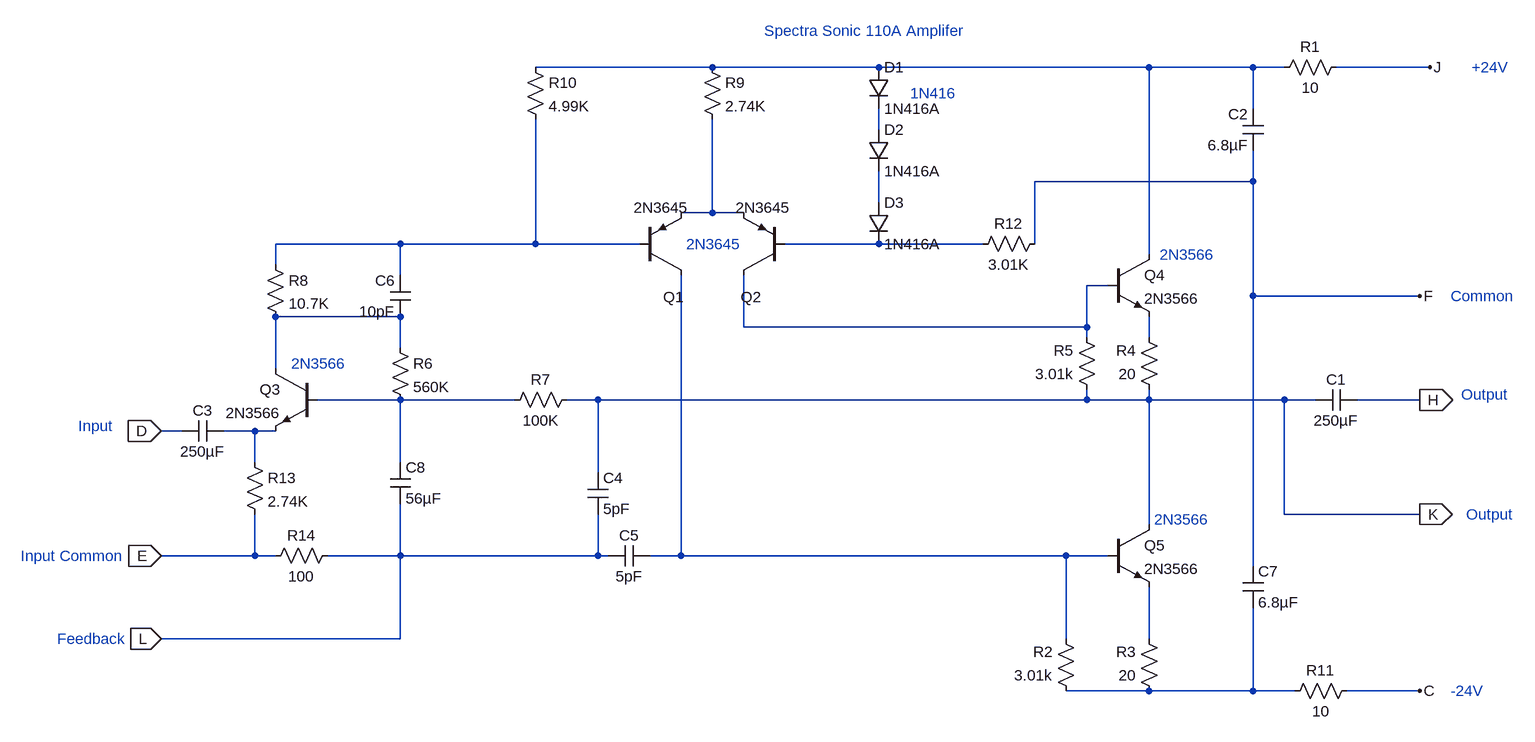
[diagram p0: schematic 110A.asc]
110A.asc, the LTspice schematic file:
Version 4.1
SHEET 1 964 4856
WIRE -1904 -1520 -2176 -1520
WIRE -1648 -1520 -1904 -1520
WIRE -1232 -1520 -1648 -1520
WIRE -1072 -1520 -1232 -1520
WIRE -1024 -1520 -1072 -1520
WIRE -800 -1520 -944 -1520
WIRE -1072 -1456 -1072 -1520
WIRE -1648 -1424 -1648 -1456
WIRE -1072 -1344 -1072 -1392
WIRE -1072 -1344 -1408 -1344
WIRE -1648 -1312 -1648 -1360
WIRE -1904 -1296 -1904 -1440
WIRE -1904 -1296 -1952 -1296
WIRE -1856 -1296 -1904 -1296
WIRE -2384 -1248 -2576 -1248
WIRE -2176 -1248 -2176 -1440
WIRE -2176 -1248 -2384 -1248
WIRE -2016 -1248 -2176 -1248
WIRE -1648 -1248 -1792 -1248
WIRE -1488 -1248 -1648 -1248
WIRE -1408 -1248 -1408 -1344
WIRE -1232 -1232 -1232 -1520
WIRE -2576 -1216 -2576 -1248
WIRE -2384 -1200 -2384 -1248
WIRE -1296 -1184 -1328 -1184
WIRE -1072 -1168 -1072 -1344
WIRE -816 -1168 -1072 -1168
WIRE -2384 -1136 -2576 -1136
WIRE -1856 -1120 -1856 -1200
WIRE -1328 -1120 -1328 -1184
WIRE -1328 -1120 -1856 -1120
WIRE -1328 -1104 -1328 -1120
WIRE -1232 -1104 -1232 -1136
WIRE -2384 -1088 -2384 -1136
WIRE -2576 -1056 -2576 -1136
WIRE -2384 -1008 -2512 -1008
WIRE -2208 -1008 -2384 -1008
WIRE -2080 -1008 -2128 -1008
WIRE -1328 -1008 -1328 -1024
WIRE -1328 -1008 -2080 -1008
WIRE -1232 -1008 -1232 -1024
WIRE -1232 -1008 -1328 -1008
WIRE -1024 -1008 -1232 -1008
WIRE -976 -1008 -1024 -1008
WIRE -816 -1008 -912 -1008
WIRE -2720 -960 -2752 -960
WIRE -2608 -960 -2656 -960
WIRE -2576 -960 -2608 -960
WIRE -2608 -912 -2608 -960
WIRE -2384 -912 -2384 -1008
WIRE -2080 -896 -2080 -1008
WIRE -1024 -832 -1024 -1008
WIRE -816 -832 -1024 -832
WIRE -1232 -816 -1232 -1008
WIRE -2608 -768 -2608 -832
WIRE -2608 -768 -2752 -768
WIRE -2576 -768 -2608 -768
WIRE -2384 -768 -2384 -848
WIRE -2384 -768 -2496 -768
WIRE -2080 -768 -2080 -832
WIRE -2080 -768 -2384 -768
WIRE -2064 -768 -2080 -768
WIRE -1952 -768 -1952 -1200
WIRE -1952 -768 -2000 -768
WIRE -1360 -768 -1952 -768
WIRE -1296 -768 -1360 -768
WIRE -1072 -752 -1072 -1168
WIRE -2384 -640 -2384 -768
WIRE -2384 -640 -2752 -640
WIRE -1360 -640 -1360 -768
WIRE -1232 -640 -1232 -720
WIRE -1232 -560 -1360 -560
WIRE -1072 -560 -1072 -688
WIRE -1072 -560 -1232 -560
WIRE -1008 -560 -1072 -560
WIRE -816 -560 -928 -560
FLAG -800 -1520 J
FLAG -2752 -960 D
IOPIN -2752 -960 In
FLAG -2752 -768 E
IOPIN -2752 -768 In
FLAG -816 -560 C
FLAG -816 -832 K
IOPIN -816 -832 Out
FLAG -816 -1168 F
FLAG -816 -1008 H
IOPIN -816 -1008 Out
FLAG -2752 -640 L
IOPIN -2752 -640 In
SYMBOL pnp -1792 -1200 R180
WINDOW 0 36 -34 Left 2
WINDOW 3 -9 104 Left 2
SYMATTR InstName Q2
SYMATTR Value 2N3645
SYMBOL pnp -2016 -1200 M180
WINDOW 0 36 -34 Left 2
WINDOW 3 -9 104 Left 2
SYMATTR InstName Q1
SYMATTR Value 2N3645
SYMBOL npn -2512 -1056 M0
SYMATTR InstName Q3
SYMATTR Value 2N3566
SYMBOL npn -1296 -1232 R0
SYMATTR InstName Q4
SYMATTR Value 2N3566
SYMBOL npn -1296 -816 R0
SYMATTR InstName Q5
SYMATTR Value 2N3566
SYMBOL diode -1664 -1520 R0
SYMATTR InstName D1
SYMATTR Value 1N416A
SYMBOL diode -1664 -1424 R0
SYMATTR InstName D2
SYMATTR Value 1N416A
SYMBOL diode -1664 -1312 R0
SYMATTR InstName D3
SYMATTR Value 1N416A
SYMBOL res -928 -1536 R90
WINDOW 0 0 56 VBottom 2
WINDOW 3 32 56 VTop 2
SYMATTR InstName R1
SYMATTR Value 10
SYMBOL res -1344 -544 R180
WINDOW 0 36 76 Left 2
WINDOW 3 36 40 Left 2
SYMATTR InstName R2
SYMATTR Value 3.01k
SYMBOL res -1216 -544 R180
WINDOW 0 36 76 Left 2
WINDOW 3 36 40 Left 2
SYMATTR InstName R3
SYMATTR Value 20
SYMBOL res -1216 -1008 R180
WINDOW 0 36 76 Left 2
WINDOW 3 36 40 Left 2
SYMATTR InstName R4
SYMATTR Value 20
SYMBOL res -1312 -1008 R180
WINDOW 0 36 76 Left 2
WINDOW 3 36 40 Left 2
SYMATTR InstName R5
SYMATTR Value 3.01k
SYMBOL cap -912 -1024 R90
WINDOW 0 0 32 VBottom 2
WINDOW 3 32 32 VTop 2
SYMATTR InstName C1
SYMATTR Value 250µF
SYMBOL cap -1056 -1392 R180
WINDOW 0 24 56 Left 2
WINDOW 3 24 8 Left 2
SYMATTR InstName C2
SYMATTR Value 6.8µF
SYMBOL cap -2656 -976 R90
WINDOW 0 0 32 VBottom 2
WINDOW 3 32 32 VTop 2
SYMATTR InstName C3
SYMATTR Value 250µF
SYMBOL res -2400 -1104 R0
SYMATTR InstName R6
SYMATTR Value 560K
SYMBOL res -2112 -1024 R90
WINDOW 0 0 56 VBottom 2
WINDOW 3 32 56 VTop 2
SYMATTR InstName R7
SYMATTR Value 100K
SYMBOL cap -2096 -896 R0
SYMATTR InstName C4
SYMATTR Value 5pF
SYMBOL cap -2000 -784 R90
WINDOW 0 0 32 VBottom 2
WINDOW 3 32 32 VTop 2
SYMATTR InstName C5
SYMATTR Value 5pF
SYMBOL cap -2368 -1136 R180
WINDOW 0 24 56 Left 2
WINDOW 3 24 8 Left 2
SYMATTR InstName C6
SYMATTR Value 10pF
SYMBOL res -2592 -1232 R0
SYMATTR InstName R8
SYMATTR Value 10.7K
SYMBOL res -1920 -1536 R0
SYMATTR InstName R9
SYMATTR Value 2.74K
SYMBOL res -2192 -1536 R0
SYMATTR InstName R10
SYMATTR Value 4.99K
SYMBOL res -912 -576 R90
WINDOW 0 0 56 VBottom 2
WINDOW 3 32 56 VTop 2
SYMATTR InstName R11
SYMATTR Value 10
SYMBOL cap -1088 -752 R0
SYMATTR InstName C7
SYMATTR Value 6.8µF
SYMBOL res -1392 -1264 R90
WINDOW 0 0 56 VBottom 2
WINDOW 3 32 56 VTop 2
SYMATTR InstName R12
SYMATTR Value 3.01K
SYMBOL res -2624 -928 R0
SYMATTR InstName R13
SYMATTR Value 2.74K
SYMBOL res -2480 -784 R90
WINDOW 0 0 56 VBottom 2
WINDOW 3 32 56 VTop 2
SYMATTR InstName R14
SYMATTR Value 100
SYMBOL cap -2400 -912 R0
SYMATTR InstName C8
SYMATTR Value 56µF
TEXT -1600 -1480 Left 2 ;1N416
TEXT -1944 -1248 Left 2 ;2N3645
TEXT -2552 -1064 Left 2 ;2N3566
TEXT -1216 -1232 Left 2 ;2N3566
TEXT -1224 -824 Left 2 ;2N3566
TEXT -736 -1520 Left 2 ;+24V
TEXT -768 -560 Left 2 ;-24V
TEXT -752 -1016 Left 2 ;Output
TEXT -744 -832 Left 2 ;Output
TEXT -768 -1168 Left 2 ;Common
TEXT -2880 -968 Left 2 ;Input
TEXT -2968 -768 Left 2 ;Input Common
TEXT -2912 -640 Left 2 ;Feedback
TEXT -1824 -1576 Left 2 ;Spectra Sonic 110A Amplifer

The netlist it stands for:
* 110A.asc
Q2 N007 N006 N004 0 2N3645
Q1 N012 N005 N004 0 2N3645
Q3 N008 N010 N011 0 2N3566
Q4 N001 N007 N009 0 2N3566
Q5 K N012 N013 0 2N3566
D1 N001 N002 1N416A
D2 N002 N003 1N416A
D3 N003 N006 1N416A
R1 J N001 10
R2 N014 N012 3.01k
R3 N014 N013 20
R4 K N009 20
R5 K N007 3.01k
C1 H K 250µF
C2 F N001 6.8µF
C3 N011 D 250µF
R6 N008 N010 560K
R7 K N010 100K
C4 K L 5pF
C5 N012 L 5pF
C6 N008 N005 10pF
R8 N005 N008 10.7K
R9 N001 N004 2.74K
R10 N001 N005 4.99K
R11 C N014 10
C7 F N014 6.8µF
R12 F N006 3.01K
R13 N011 E 2.74K
R14 L E 100
C8 N010 L 56µF
.model D D
.lib standard.dio
.model NPN NPN
.model PNP PNP
.lib standard.bjt
* 1N416
* 2N3645
* 2N3566
* 2N3566
* 2N3566
* +24V
* -24V
* Output
* Output
* Common
* Input
* Input Common
* Feedback
* Spectra Sonic 110A Amplifer
.backanno
.end